# Altium schematic sheet KSZ - ETH HUB.SchDoc: ETHERNET SWITCH LAYER 2
size A2; DrawnBy: Luca Schenetti; Revision: C; SheetNumber: 3; SheetTotal: 5
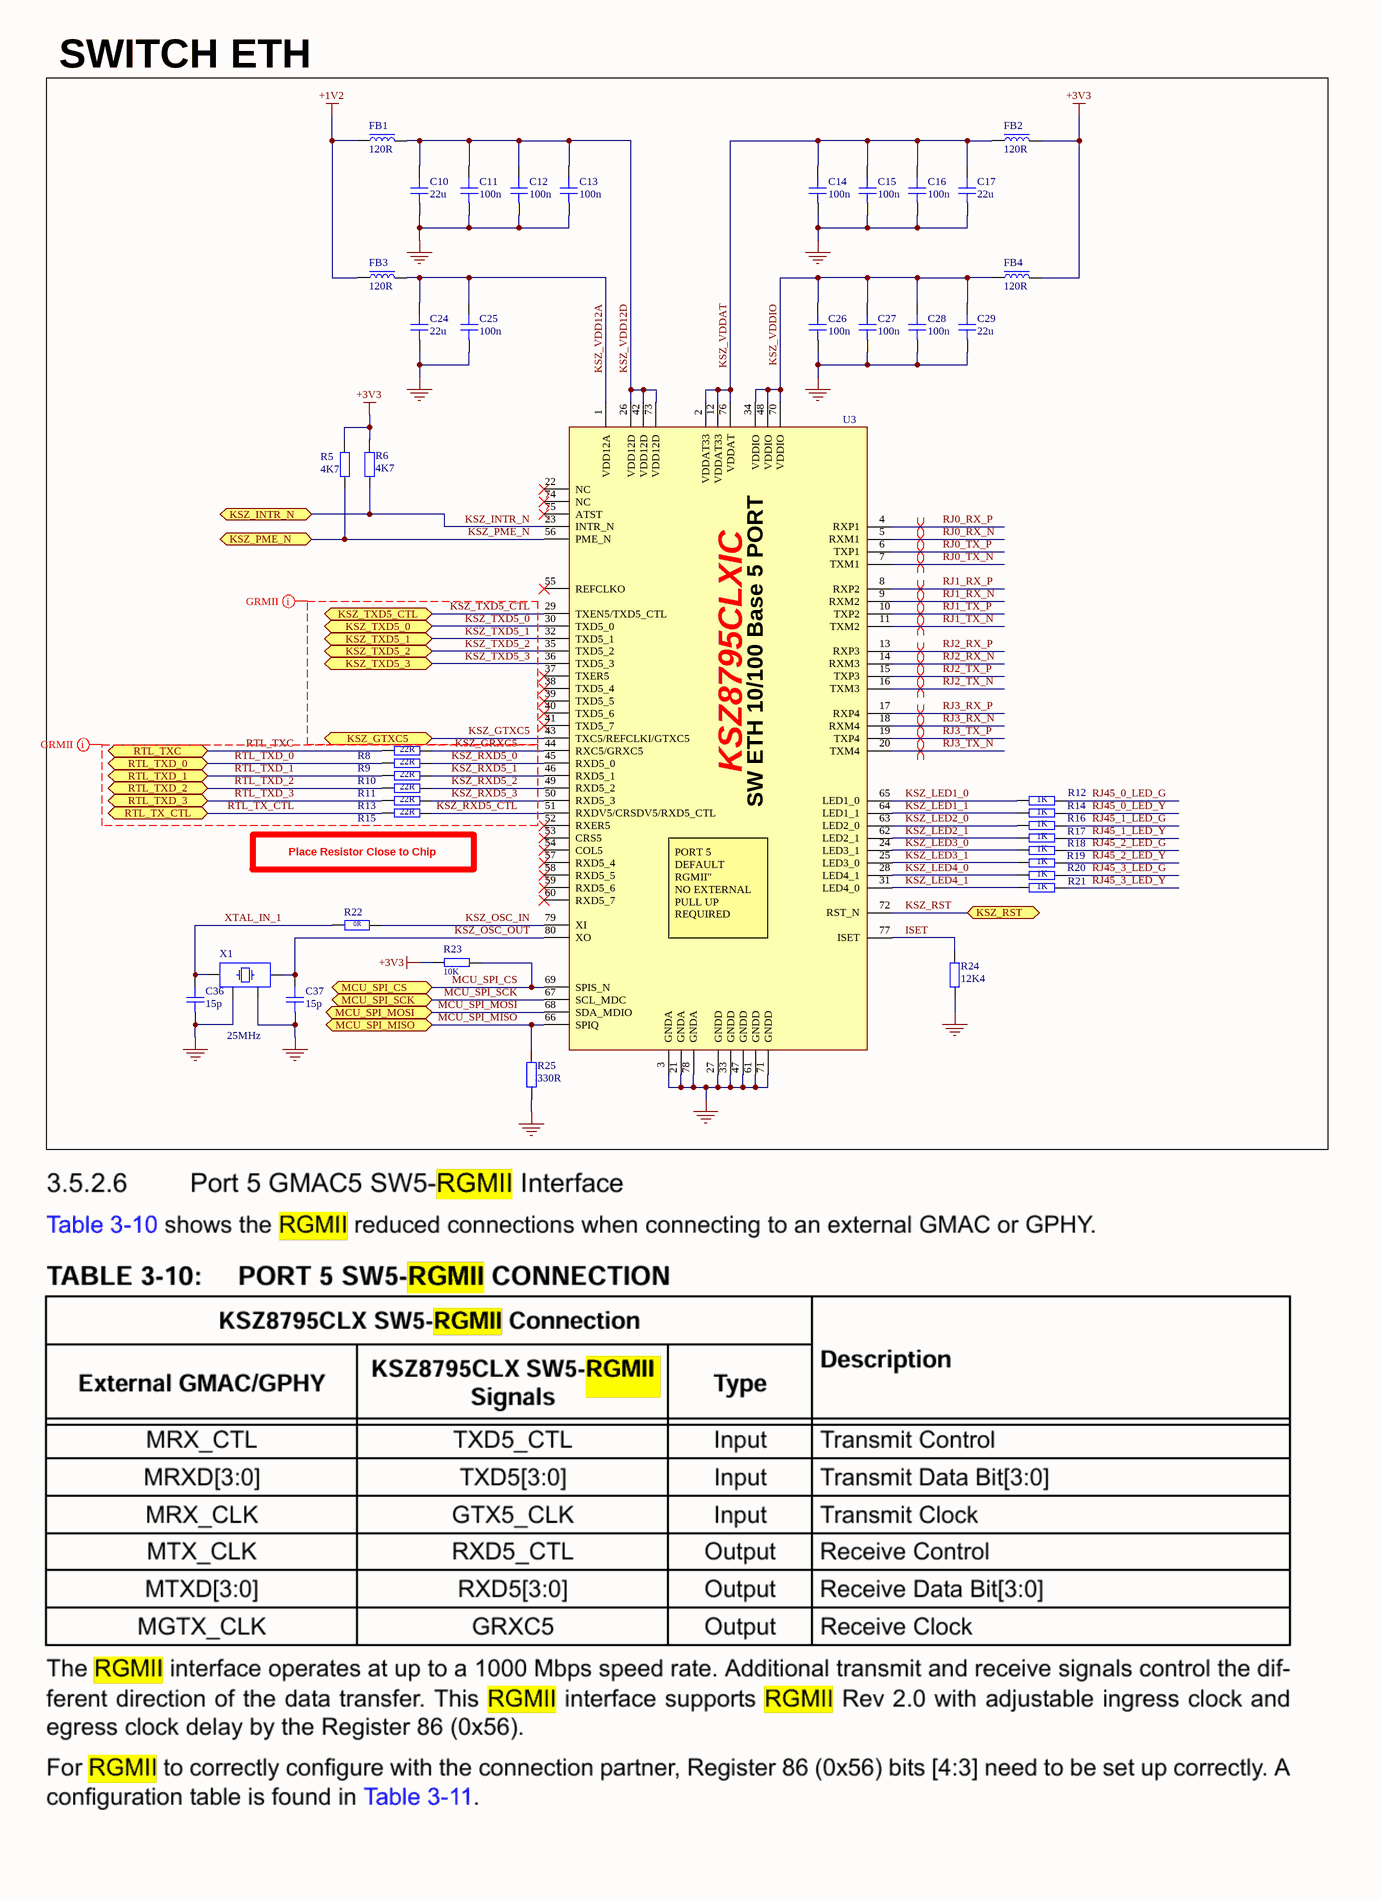
[diagram p0: KSZ - ETH HUB.SchDoc, left]
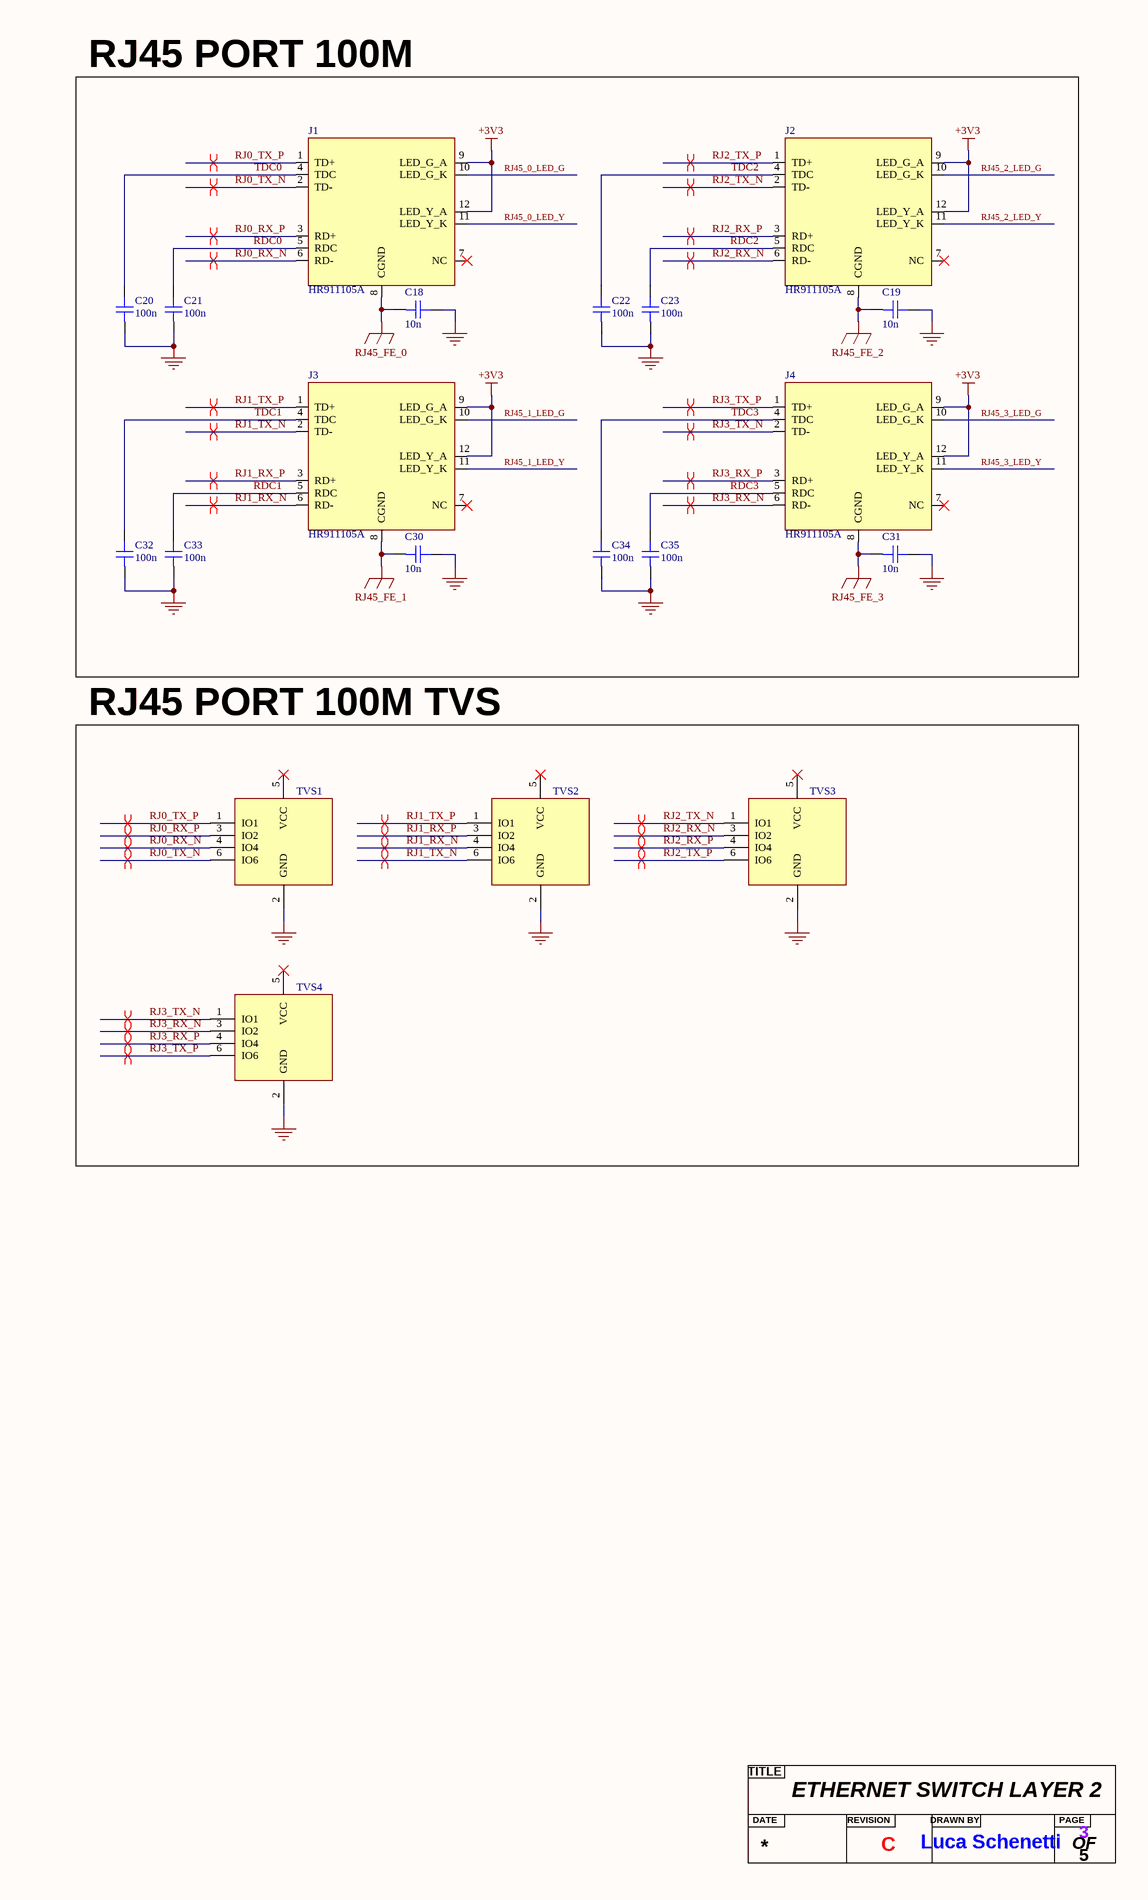
[diagram p1: KSZ - ETH HUB.SchDoc, right]

## Parts
?  Title  (value not drawn)  (graphical)
C10  22u  [CAP_0603]
C11  100n  [CAP_0603]
C12  100n  [CAP_0603]
C13  100n  [CAP_0603]
C14  100n  [CAP_0603]
C15  100n  [CAP_0603]
C16  100n  [CAP_0603]
C17  22u  [CAP_0603]
C18  10n  [CAP_1206]
C19  10n  [CAP_1206]
C20  100n  [CAP_0603]
C21  100n  [CAP_0603]
C22  100n  [CAP_0603]
C23  100n  [CAP_0603]
C24  22u  [CAP_0603]
C25  100n  [CAP_0603]
C26  100n  [CAP_0603]
C27  100n  [CAP_0603]
C28  100n  [CAP_0603]
C29  22u  [CAP_0603]
C30  10n  [CAP_1206]
C31  10n  [CAP_1206]
C32  100n  [CAP_0603]
C33  100n  [CAP_0603]
C34  100n  [CAP_0603]
C35  100n  [CAP_0603]
C36  15p  [CAP_0402]
C37  15p  [CAP_0402]
FB1  120R  [FB_0603]
FB2  120R  [FB_0603]
FB3  120R  [FB_0603]
FB4  120R  [FB_0603]
J1  HR911105A  [HR911105A]
J2  HR911105A  [HR911105A]
J3  HR911105A  [HR911105A]
J4  HR911105A  [HR911105A]
R5  4K7  [RES_0603]
R6  4K7  [RES_0603]
R8  22R  [RES_0402]
R9  22R  [RES_0402]
R10  22R  [RES_0402]
R11  22R  [RES_0402]
R12  1K  [RES_0603]
R13  22R  [RES_0402]
R14  1K  [RES_0603]
R15  22R  [RES_0402]
R16  1K  [RES_0603]
R17  1K  [RES_0603]
R18  1K  [RES_0603]
R19  1K  [RES_0603]
R20  1K  [RES_0603]
R21  1K  [RES_0603]
R22  0R  [RES_0402]
R23  10K  [RES_0603]
R24  12K4  [RES_0603]
R25  330R  [RES_0603]
TVS1  ESD 5A 75W 12.5V 6V Bidirectional 5V  [SRV05-4]  (value not drawn)
TVS2  ESD 5A 75W 12.5V 6V Bidirectional 5V  [SRV05-4]  (value not drawn)
TVS3  ESD 5A 75W 12.5V 6V Bidirectional 5V  [SRV05-4]  (value not drawn)
TVS4  ESD 5A 75W 12.5V 6V Bidirectional 5V  [SRV05-4]  (value not drawn)
U3  5-Port 10/100-Man Eth  [KSZ8795CLXIC]  (value not drawn)
X1  25MHz  [XTAL_3225]

## Blocks framed on the sheet
SWITCH ETH: C10-C17 C24-C29 C36 C37 FB1-FB4 R5 R6 R8-R25 U3 X1
RJ45 PORT 100M: C18-C23 C30-C35 J1-J4

## Ports
KSZ_GTXC5 (bidir, see RTL - ETH PHY[1B]), KSZ_INTR_N (bidir, see STM32 - MCU[4D]), KSZ_PME_N (bidir, see STM32 - MCU[4D]), KSZ_RST (bidir, see STM32 - MCU[8C]), KSZ_TXD5_0 (bidir, see RTL - ETH PHY[1B]), KSZ_TXD5_1 (bidir, see RTL - ETH PHY[1B]), KSZ_TXD5_2 (bidir, see RTL - ETH PHY[1B]), KSZ_TXD5_3 (bidir, see RTL - ETH PHY[1B]), KSZ_TXD5_CTL (bidir, see RTL - ETH PHY[1B]), MCU_SPI_CS (bidir, see STM32 - MCU[1C]), MCU_SPI_MISO (bidir, see STM32 - MCU[1C]), MCU_SPI_MOSI (bidir, see STM32 - MCU[1C]), MCU_SPI_SCK (bidir, see STM32 - MCU[1C]), RTL_TX_CTL (bidir, see RTL - ETH PHY[3B]), RTL_TXC (bidir, see RTL - ETH PHY[3B]), RTL_TXD_0 (bidir, see RTL - ETH PHY[3B]), RTL_TXD_1 (bidir, see RTL - ETH PHY[3B]), RTL_TXD_2 (bidir, see RTL - ETH PHY[3B]), RTL_TXD_3 (bidir, see RTL - ETH PHY[3B])

## Nets
+1V2: FB1.1 FB3.1
+3V3: FB2.2 FB4.2 J1.9(LED_G_A) J1.12(LED_Y_A) J2.9(LED_G_A) J2.12(LED_Y_A) J3.9(LED_G_A) J3.12(LED_Y_A) J4.9(LED_G_A) J4.12(LED_Y_A) R5.2 R6.2 R23.2
GND: C10.1 C11.1 C12.1 C13.1 C14.1 C15.1 C16.1 C17.1 C18.2 C19.2 C20.1 C21.1 C22.1 C23.1 C24.1 C25.1 C26.1 C27.1 C28.1 C29.1 C30.2 C31.2 C32.1 C33.1 C34.1 C35.1 C36.1 C37.1 R24.1 R25.1 TVS1.2(GND) TVS2.2(GND) TVS3.2(GND) TVS4.2(GND) U3.3(GNDA) U3.21(GNDA) U3.27(GNDD) U3.33(GNDD) U3.47(GNDD) U3.61(GNDD) U3.71(GNDD) U3.78(GNDA) X1.2 X1.4
RJ45_FE_0: C18.1 J1.8(CGND)
RJ45_FE_1: C30.1 J3.8(CGND)
RJ45_FE_2: C19.1 J2.8(CGND)
RJ45_FE_3: C31.1 J4.8(CGND)
ISET: R24.2 U3.77(ISET)
KSZ_GRXC5: R8.2 U3.44(RXC5/GRXC5)
KSZ_GTXC5: U3.43(TXC5/REFCLKI/GTXC5) ; port KSZ_GTXC5
KSZ_INTR_N: R6.1 U3.23(INTR_N) ; port KSZ_INTR_N
KSZ_LED1_0: R14.2 U3.65(LED1_0)
KSZ_LED1_1: R12.2 U3.64(LED1_1)
KSZ_LED2_0: R16.2 U3.63(LED2_0)
KSZ_LED2_1: R17.2 U3.62(LED2_1)
KSZ_LED3_0: R18.2 U3.24(LED3_1)
KSZ_LED3_1: R19.2 U3.25(LED3_0)
KSZ_LED4_0: R20.2 U3.28(LED4_1)
KSZ_LED4_1: R21.2 U3.31(LED4_0)
KSZ_OSC_IN: R22.2 U3.79(XI)
KSZ_OSC_OUT: C37.2 U3.80(XO) X1.1
KSZ_PME_N: R5.1 U3.56(PME_N) ; port KSZ_PME_N
KSZ_RST: U3.72(RST_N) ; port KSZ_RST
KSZ_RXD5_0: R9.2 U3.45(RXD5_0)
KSZ_RXD5_1: R10.2 U3.46(RXD5_1)
KSZ_RXD5_2: R11.2 U3.49(RXD5_2)
KSZ_RXD5_3: R13.2 U3.50(RXD5_3)
KSZ_RXD5_CTL: R15.2 U3.51(RXDV5/CRSDV5/RXD5_CTL)
KSZ_TXD5_0: U3.30(TXD5_0) ; port KSZ_TXD5_0
KSZ_TXD5_1: U3.32(TXD5_1) ; port KSZ_TXD5_1
KSZ_TXD5_2: U3.35(TXD5_2) ; port KSZ_TXD5_2
KSZ_TXD5_3: U3.36(TXD5_3) ; port KSZ_TXD5_3
KSZ_TXD5_CTL: U3.29(TXEN5/TXD5_CTL) ; port KSZ_TXD5_CTL
KSZ_VDD12A: C24.2 C25.2 FB3.2 U3.1(VDD12A)
KSZ_VDD12D: C10.2 C11.2 C12.2 C13.2 FB1.2 U3.26(VDD12D) U3.42(VDD12D) U3.73(VDD12D)
KSZ_VDDAT: C14.2 C15.2 C16.2 C17.2 FB2.1 U3.2(VDDAT33) U3.12(VDDAT33) U3.76(VDDAT)
KSZ_VDDIO: C26.2 C27.2 C28.2 C29.2 FB4.1 U3.34(VDDIO) U3.48(VDDIO) U3.70(VDDIO)
MCU_SPI_CS: R23.1 U3.69(SPIS_N) ; port MCU_SPI_CS
MCU_SPI_MISO: R25.2 U3.66(SPIQ) ; port MCU_SPI_MISO
MCU_SPI_MOSI: U3.68(SDA_MDIO) ; port MCU_SPI_MOSI
MCU_SPI_SCK: U3.67(SCL_MDC) ; port MCU_SPI_SCK
RDC0: C21.2 J1.5(RDC)
RDC1: C33.2 J3.5(RDC)
RDC2: C23.2 J2.5(RDC)
RDC3: C35.2 J4.5(RDC)
RJ0_RX_N: J1.6(RD-) TVS1.4(IO4) U3.5(RXM1)
RJ0_RX_P: J1.3(RD+) TVS1.3(IO2) U3.4(RXP1)
RJ0_TX_N: J1.2(TD-) TVS1.6(IO6) U3.7(TXM1)
RJ0_TX_P: J1.1(TD+) TVS1.1(IO1) U3.6(TXP1)
RJ1_RX_N: J3.6(RD-) TVS2.4(IO4) U3.9(RXM2)
RJ1_RX_P: J3.3(RD+) TVS2.3(IO2) U3.8(RXP2)
RJ1_TX_N: J3.2(TD-) TVS2.6(IO6) U3.11(TXM2)
RJ1_TX_P: J3.1(TD+) TVS2.1(IO1) U3.10(TXP2)
RJ2_RX_N: J2.6(RD-) TVS3.3(IO2) U3.14(RXM3)
RJ2_RX_P: J2.3(RD+) TVS3.4(IO4) U3.13(RXP3)
RJ2_TX_N: J2.2(TD-) TVS3.1(IO1) U3.16(TXM3)
RJ2_TX_P: J2.1(TD+) TVS3.6(IO6) U3.15(TXP3)
RJ3_RX_N: J4.6(RD-) TVS4.3(IO2) U3.18(RXM4)
RJ3_RX_P: J4.3(RD+) TVS4.4(IO4) U3.17(RXP4)
RJ3_TX_N: J4.2(TD-) TVS4.1(IO1) U3.20(TXM4)
RJ3_TX_P: J4.1(TD+) TVS4.6(IO6) U3.19(TXP4)
RJ45_0_LED_G: J1.10(LED_G_K) R14.1
RJ45_0_LED_Y: J1.11(LED_Y_K) R12.1
RJ45_1_LED_G: J3.10(LED_G_K) R16.1
RJ45_1_LED_Y: J3.11(LED_Y_K) R17.1
RJ45_2_LED_G: J2.10(LED_G_K) R18.1
RJ45_2_LED_Y: J2.11(LED_Y_K) R19.1
RJ45_3_LED_G: J4.10(LED_G_K) R20.1
RJ45_3_LED_Y: J4.11(LED_Y_K) R21.1
RTL_TX_CTL: R15.1 ; port RTL_TX_CTL
RTL_TXC: R8.1 ; port RTL_TXC
RTL_TXD_0: R9.1 ; port RTL_TXD_0
RTL_TXD_1: R10.1 ; port RTL_TXD_1
RTL_TXD_2: R11.1 ; port RTL_TXD_2
RTL_TXD_3: R13.1 ; port RTL_TXD_3
TDC0: C20.2 J1.4(TDC)
TDC1: C32.2 J3.4(TDC)
TDC2: C22.2 J2.4(TDC)
TDC3: C34.2 J4.4(TDC)
XTAL_IN_1: C36.2 R22.1 X1.3

Not connected (* = marked no-connect by the designer): J1 7(NC)*; J2 7(NC)*; J3 7(NC)*; J4 7(NC)*; TVS1 5(VCC)*; TVS2 5(VCC)*; TVS3 5(VCC)*; TVS4 5(VCC)*; U3 22(NC)* 37(TXER5)* 38(TXD5_4)* 39(TXD5_5)* 40(TXD5_6)* 41(TXD5_7)* 52(RXER5)* 53(CRS5)* 54(COL5)* 55(REFCLKO)* 57(RXD5_4)* 58(RXD5_5)* 59(RXD5_6)* 60(RXD5_7)* 74(NC)* 75(ATST)*

## Layout directives
differential pair; differential pair class DIFF_MDI_100Ω: RJ0_RX_N, RJ0_RX_P, RJ0_TX_N, RJ0_TX_P, RJ1_RX_N, RJ1_RX_P, RJ1_TX_N, RJ1_TX_P, RJ2_RX_N, RJ2_RX_P, RJ2_TX_N, RJ2_TX_P, RJ3_RX_N, RJ3_RX_P, RJ3_TX_N, RJ3_TX_P
net class GRMII_RX; rule Matched Net Lengths [Delay Tolerance = 20ps]: KSZ_GTXC5, KSZ_TXD5_0, KSZ_TXD5_1, KSZ_TXD5_2, KSZ_TXD5_3, KSZ_TXD5_CTL
net class GRMII_TX; rule Matched Net Lengths [Delay Tolerance = 20ps]: KSZ_GRXC5, KSZ_RXD5_0, KSZ_RXD5_1, KSZ_RXD5_2, KSZ_RXD5_3, KSZ_RXD5_CTL, RTL_TX_CTL, RTL_TXC, RTL_TXD_0, RTL_TXD_1, RTL_TXD_2, RTL_TXD_3

## Notes on the sheet
- RJ45 PORT 100M TVS
- Place Resistor Close to Chip
- (near U3) PORT 5 DEFAULT RGMII"
  NO EXTERNAL PULL UP REQUIRED
- (in symbol KSZ8795CLXIC) SW ETH 10/100 Base 5 PORT
- (in symbol Title) TITLE; DATE; REVISION; DRAWN BY; PAGE; OF

## Library data of the parts
C10 C17 C24 C29 = CAP_0603: Capacitor SMD 0603 [C59461]; Manufacturer: *; Manufacturer Part Number: *; Distributor Link: *; LCSC: *; Rating: *; Dielectric: *
C11-C16 C20-C23 C25-C28 C32-C35 = CAP_0603: Capacitor SMD 0603 [C14663]; Manufacturer: *; Manufacturer Part Number: *; Distributor Link: *; LCSC: *; Rating: *; Dielectric: *
C18 C19 C30 C31 = CAP_1206: [C1846]; Manufacturer: *; Manufacturer Part Number: *; Distributor Link: *; LCSC: *; Rating: *; Dielectric: *
C36 C37 = CAP_0402: Capacitor SMD 0402 [C1548]; Manufacturer: *; Manufacturer Part Number: *; Distributor Link: *; LCSC: *; Rating: *; Dielectric: *
FB1-FB4 = FB_0603: Ferrite Bead SMD 0603[C76892]; Manufacturer: *; Manufacturer Part Number: *; Distributor Link: *; LCSC: *
J1-J4 = HR911105A: Single Port RJ45 Connector w/ Integrated Magnetic and LED 10/100 Base-T [C12074]; Manufacturer: HanRun; Manufacturer Part Number: HR911105A
R5 R6 = RES_0603: [C23162]; Manufacturer: *; Manufacturer Part Number: *; Distributor Link: *; LCSC: *
R8-R11 R13 R15 = RES_0402: [C25092]; Manufacturer: *; Manufacturer Part Number: *; Distributor Link: *; LCSC: *
R12 R14 R16-R21 = RES_0603: [C21190]; Manufacturer: *; Manufacturer Part Number: *; Distributor Link: *; LCSC: *
R22 = RES_0402: Resistor SMD 0402 [C17168]; Manufacturer: *; Manufacturer Part Number: *; Distributor Link: *; LCSC: *
R23 = RES_0603: [C25804]; Manufacturer: *; Manufacturer Part Number: *; Distributor Link: *; LCSC: *
R24 = RES_0603: [C22865]; Manufacturer: *; Manufacturer Part Number: *; Distributor Link: *; LCSC: *
R25 = RES_0603: [C23138]; Manufacturer: *; Manufacturer Part Number: *; Distributor Link: *; LCSC: *
TVS1-TVS4 = SRV05-4: [C7420376]
U3 = KSZ8795CLXIC: [C69416]
X1 = TSX-3225_24.0000MF15X-AC: Crystal SMD 24MHz 10PPM 7pF 3225 [C9006]; Manufacturer: Epson; Manufacturer Part Number: TSX-3225 24.0000MF15X-AC